# Altium schematic sheet Archimedes_Endstop_Kati.SchDoc: End Stop Katı Tasarımı
size A4; DrawnBy: Emre Rasim; DocumentNumber: 3; Revision: 1.0; SheetNumber: 6; SheetTotal: 7; Sematikicerigi: End Stop Katı Tasarımı
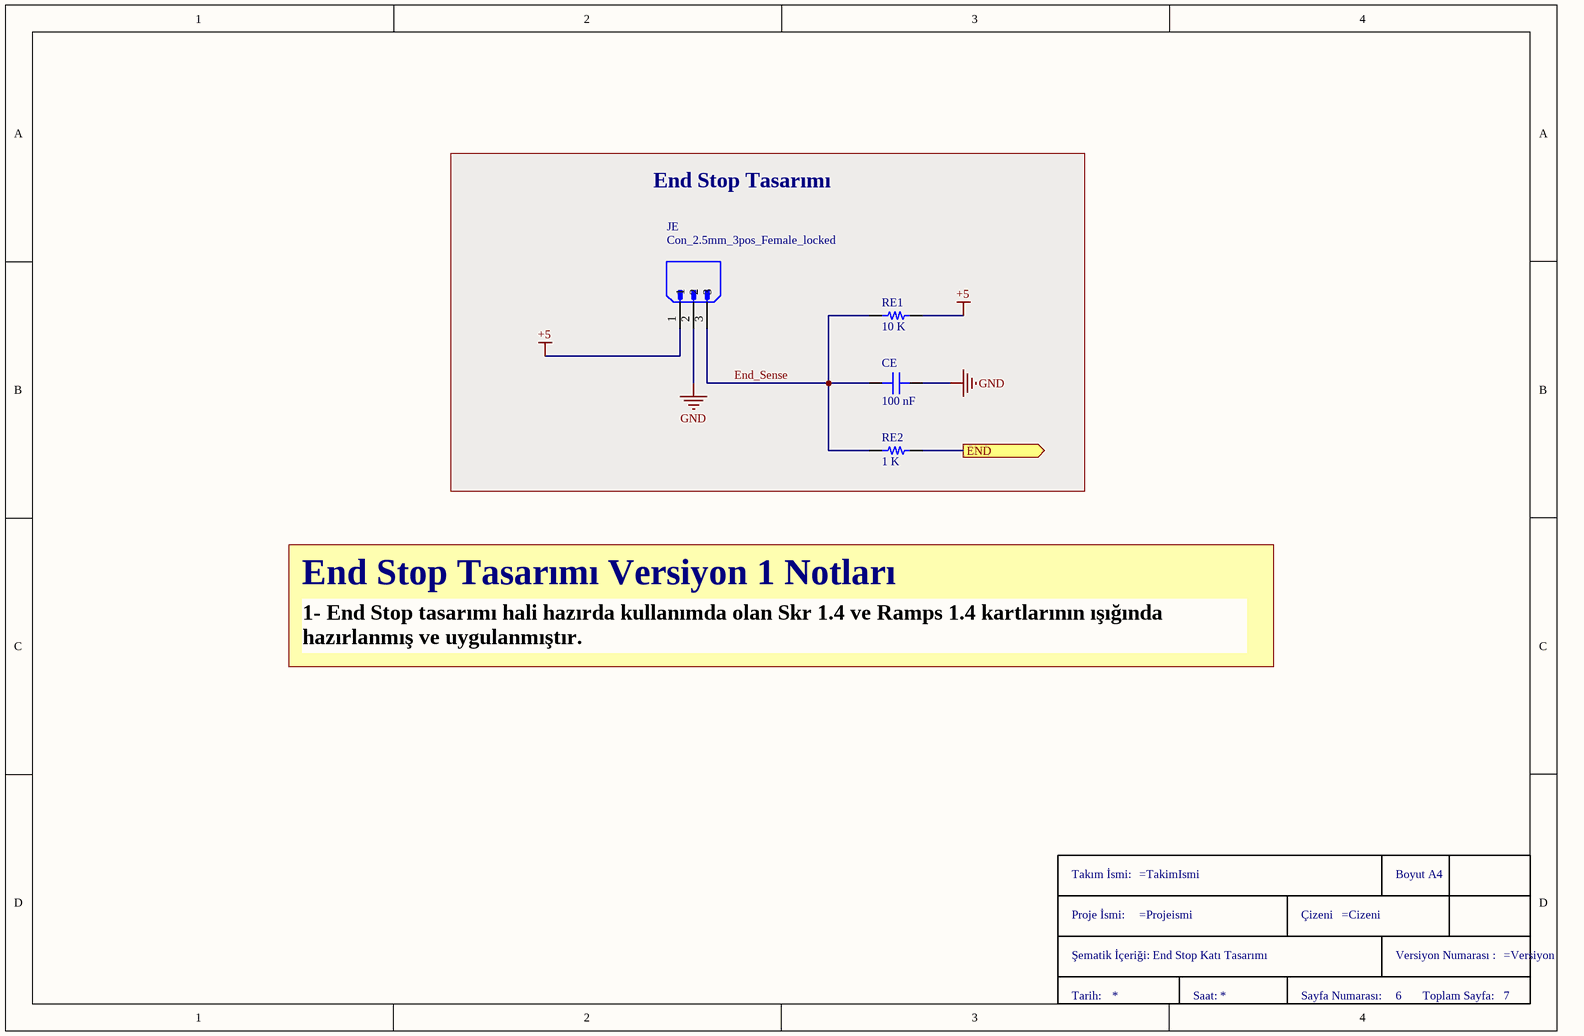
[diagram p0: Archimedes_Endstop_Kati.SchDoc]

## Parts
CE  100 nF  [CAP 0805/2012]
JE  Con_2.5mm_3pos_Female_locked  [Con_3lead_2.5mm_locked]
RE1  10 K  [RES 0805/2012]
RE2  1 K  [RES 0805/2012]
TitleBlock-A4  TitleBlock-A4  (value not drawn)  (graphical)

## Blocks framed on the sheet
End Stop Tasarımı: CE JE RE1 RE2

## Ports
END (out)

## Nets
+5: JE.1 RE1.2
GND: CE.2 JE.2
END: RE2.2 ; port END
End_Sense: CE.1 JE.3 RE1.1 RE2.1

## Notes on the sheet
- End Stop Tasarımı Versiyon 1 Notları
- 1- End Stop tasarımı hali hazırda kullanımda olan Skr 1.4 ve Ramps 1.4 kartlarının ışığında hazırlanmış ve uygulanmıştır.
- (in symbol TitleBlock-A4) Takım İsmi:; Boyut A4; Proje İsmi:; Çizeni; Şematik İçeriği:; Versiyon Numarası :; Tarih:; Saat:; Sayfa Numarası:; Toplam Sayfa:

## Library data of the parts
CE = Capacitor 805: 100 nF  and 50 Volt Ceramic Capacitor 805 pack with X7R rating
JE = Con_2.5mm_3pos_Female_locked: 3 lead female locked connector for 3d printer limit switch; MP: B3B-XH-A(LF)(SN); Value: *; Availability: Unavailable; Package: None; Price: None
RE1 = Resistor 805: 10 K ohm Resistor  with 805 pack and %1 tolerance rating
RE2 = Resistor 805: 1 K ohm Resistor  with 805 pack and %1 tolerance rating
TitleBlock-A4 = TitleBlock-A4: Title Block for İTU eklemeli imalat takımı